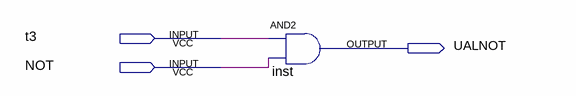
[diagram p0: schematic sheet]
// Quartus schematic UALNOT.bdf as structural Verilog: 1 symbols, 3 pins
module UALNOT (
  input  t3,
  input  NOT,
  output UALNOT
);

  and inst (UALNOT, t3, NOT);
endmodule
